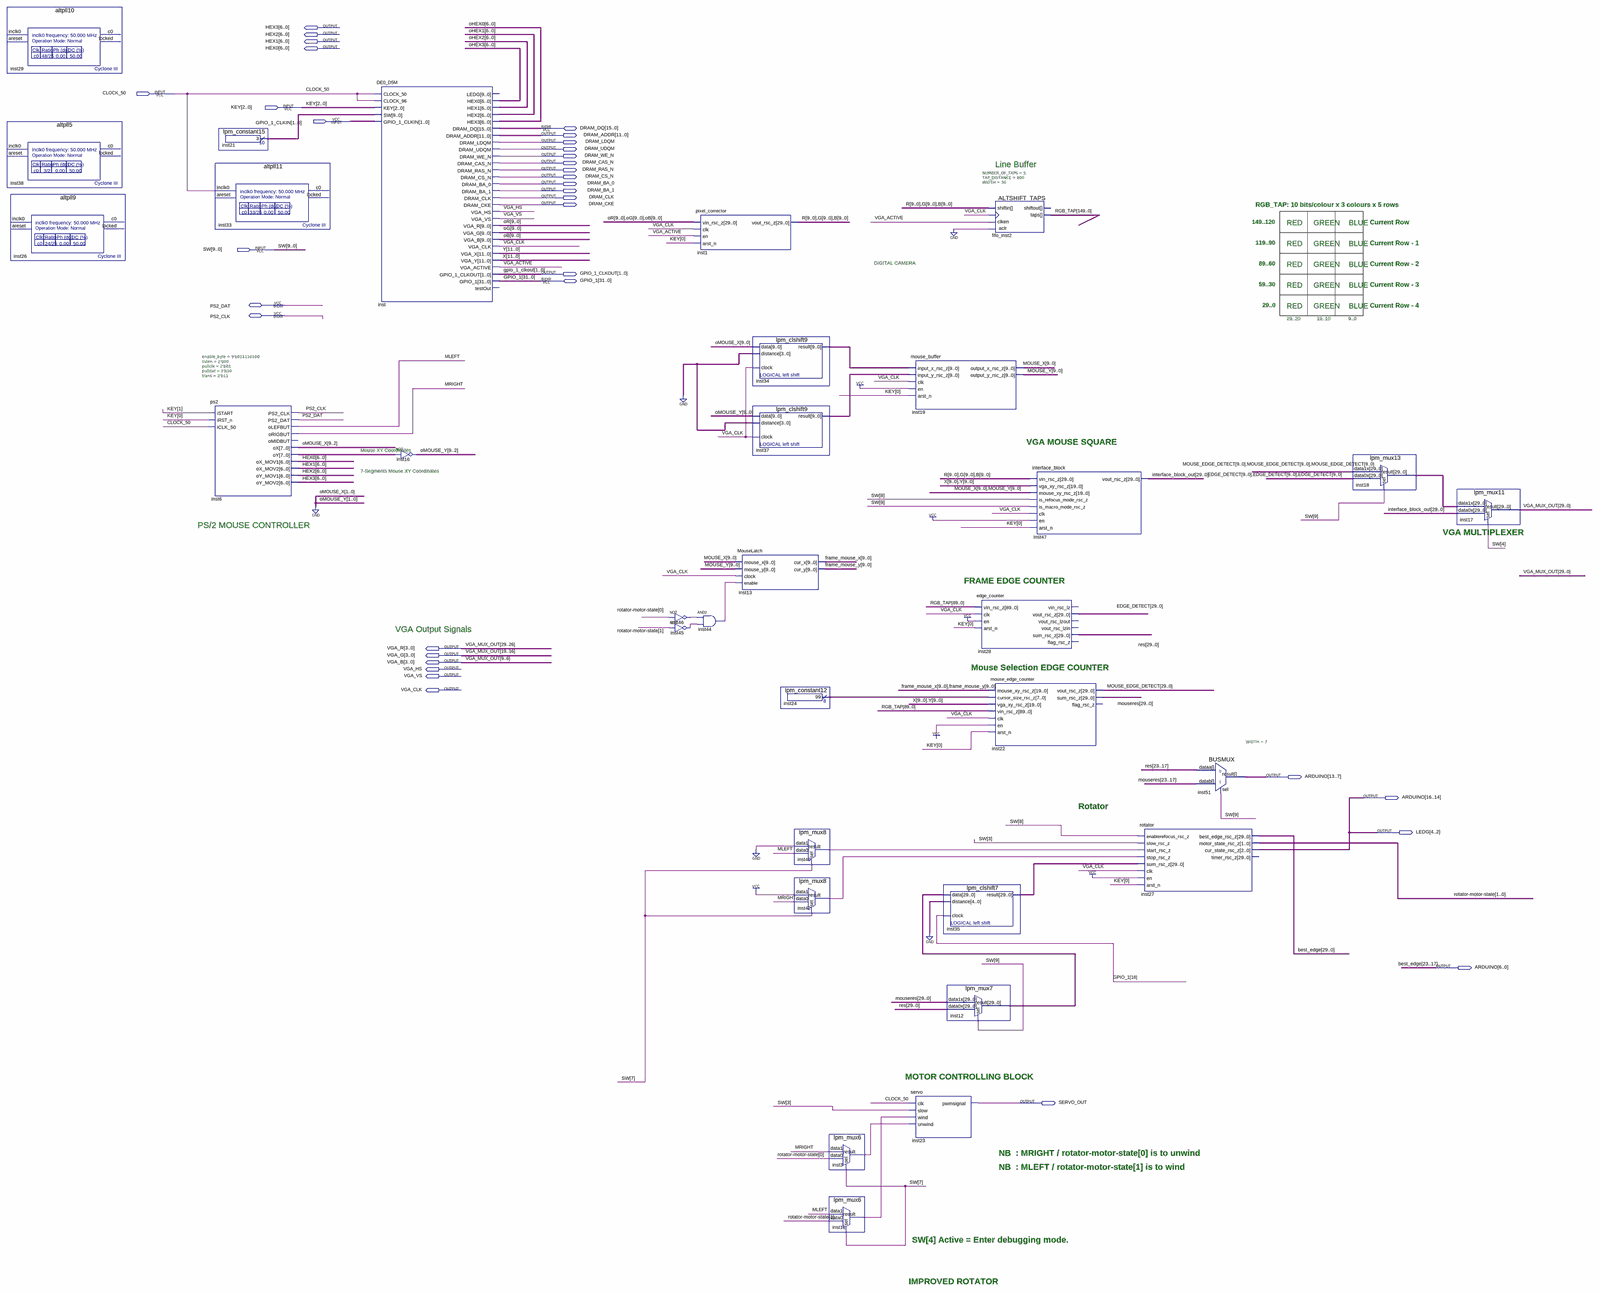
[diagram p0: schematic sheet, whole]
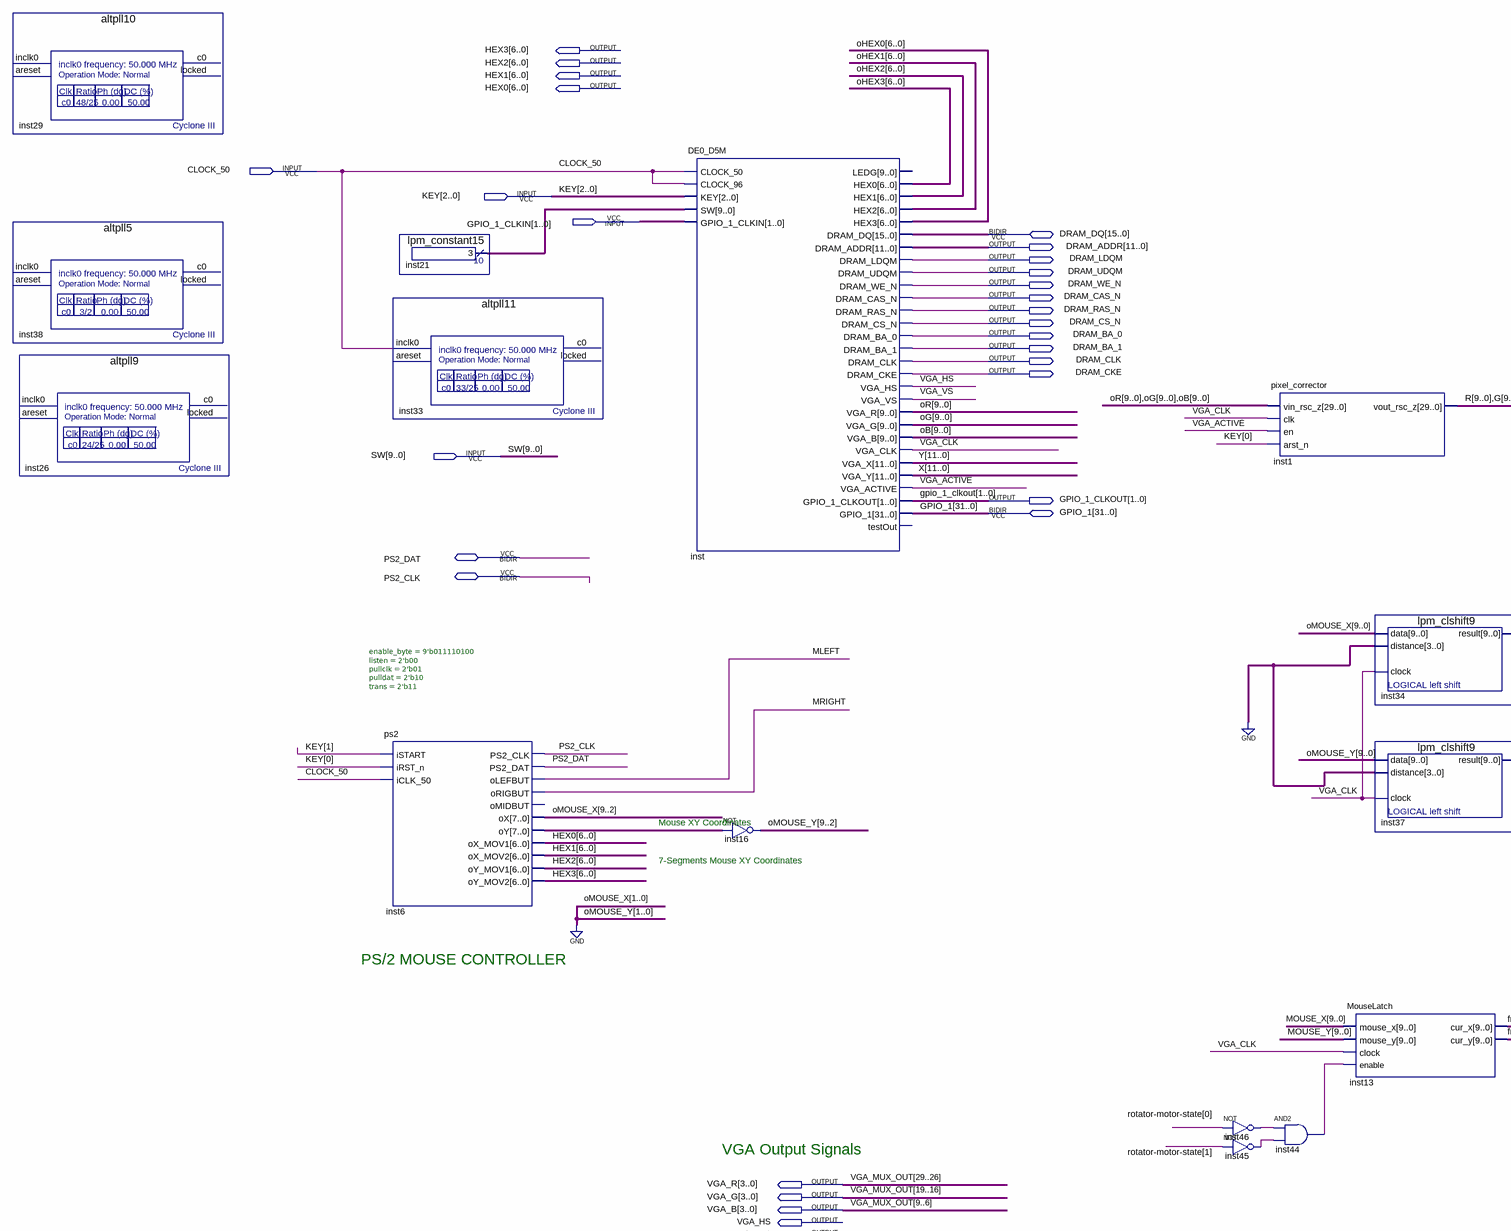
[diagram p1: schematic sheet, upper left part]
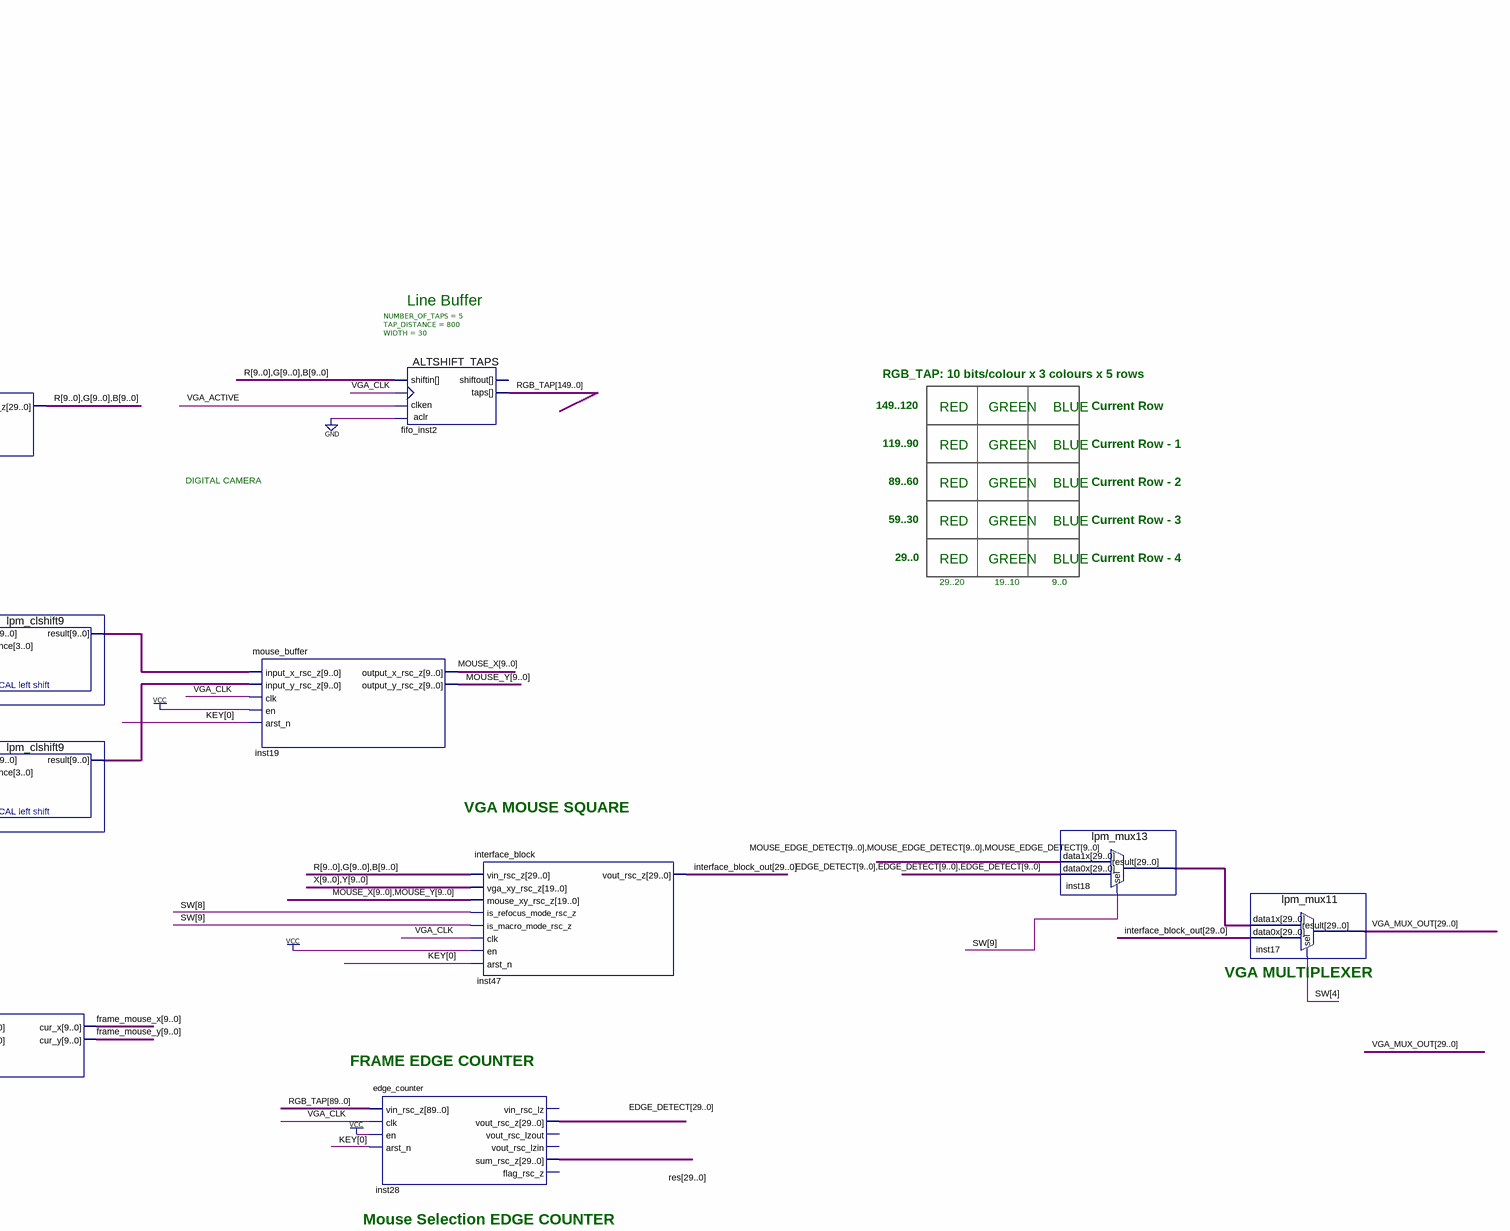
[diagram p2: schematic sheet, upper right part]
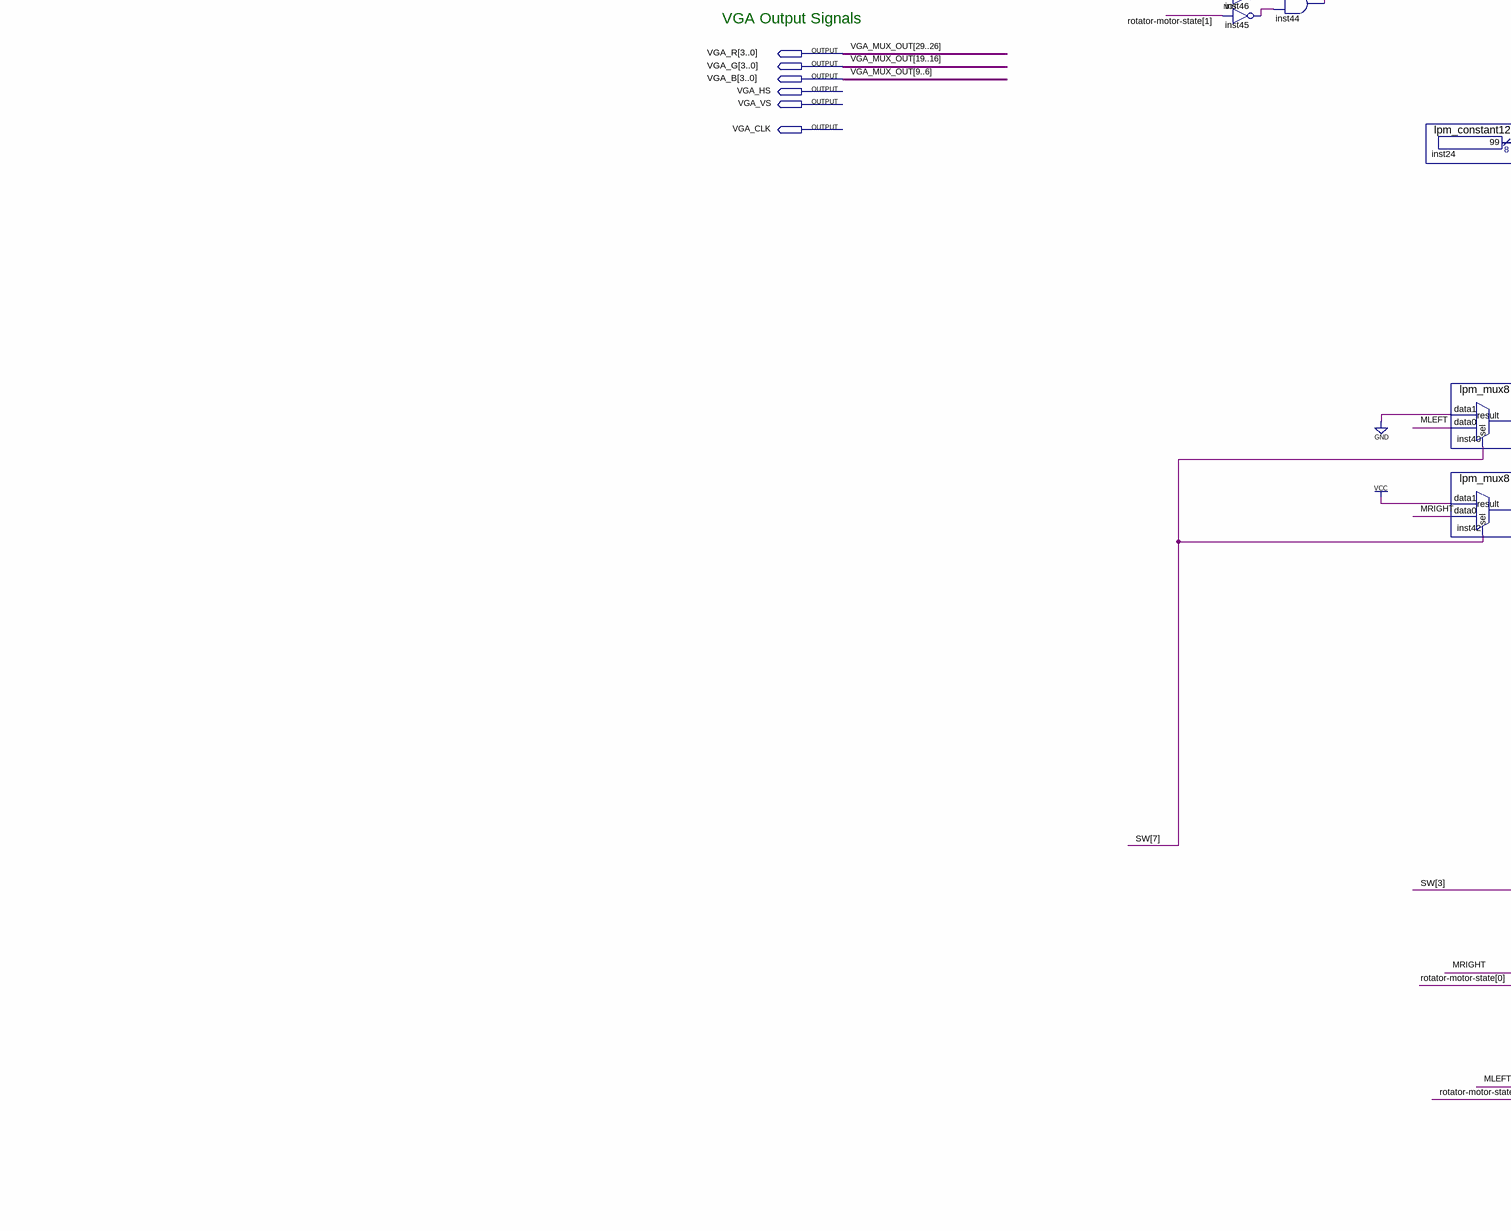
[diagram p3: schematic sheet, lower left part]
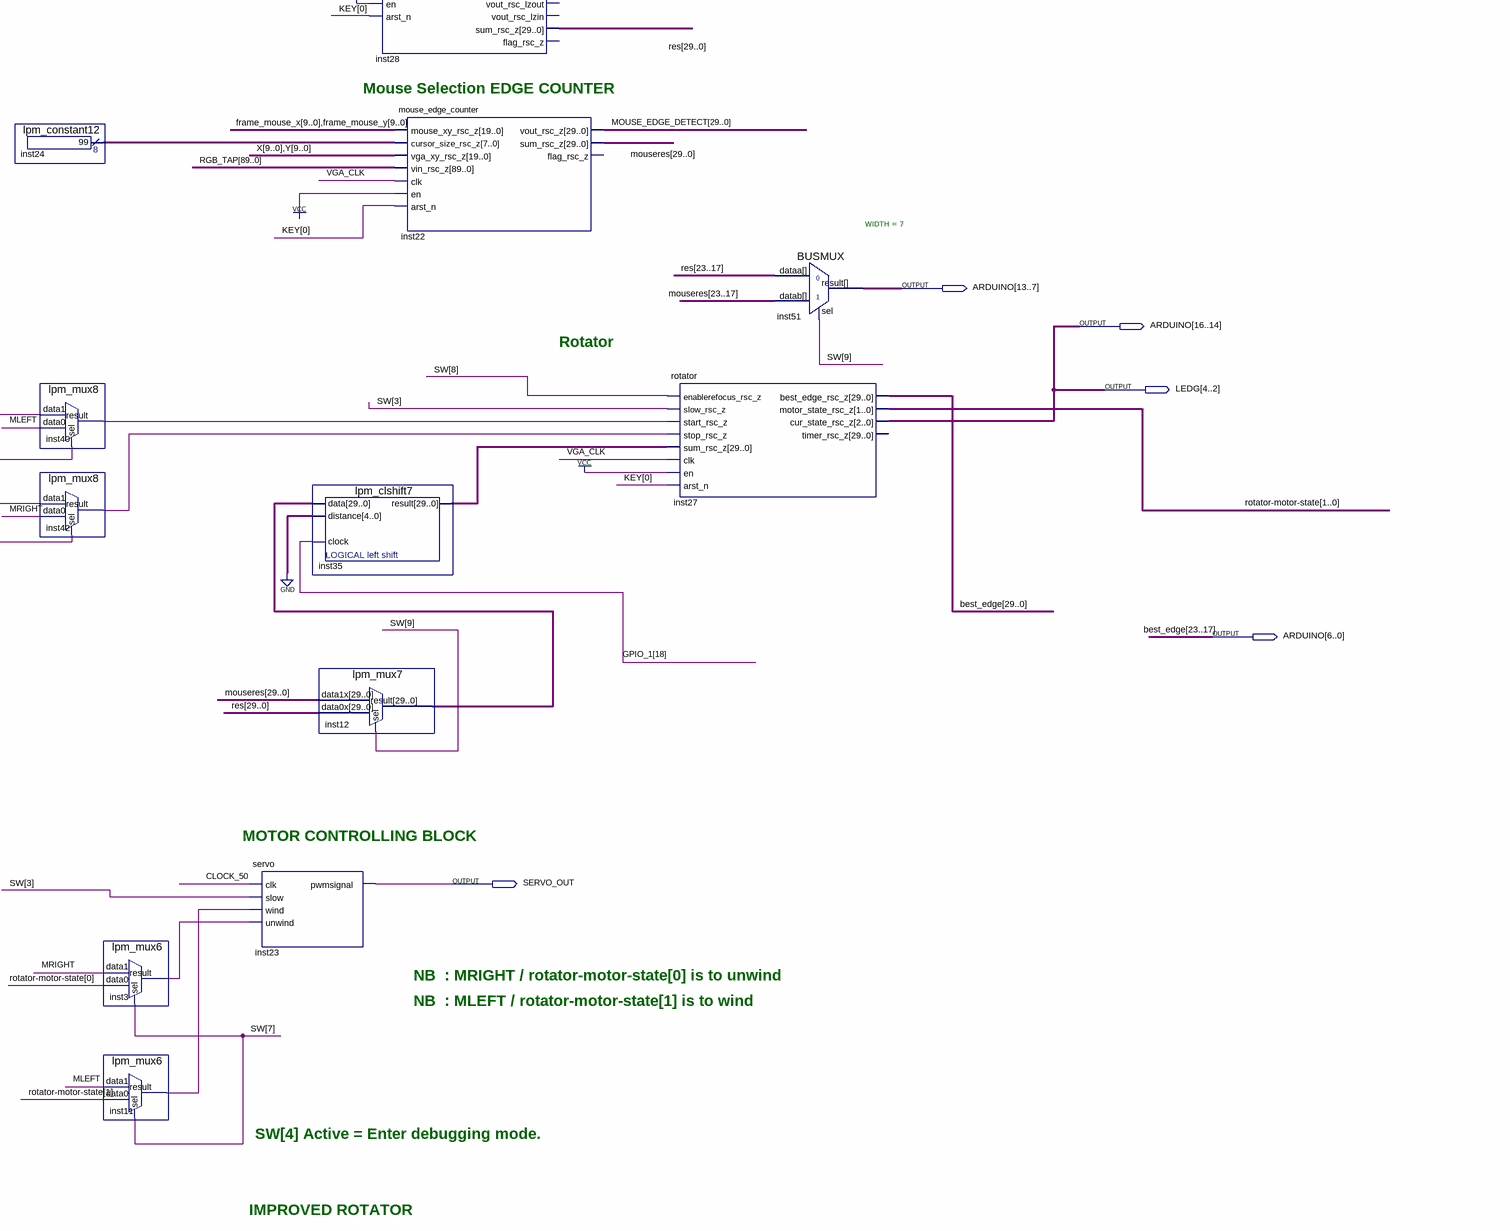
[diagram p4: schematic sheet, lower right part]
// Quartus schematic TOP_DE0_CAMERA_MOUSE.bdf as structural Verilog: 32 symbols, 35 pins
module TOP_DE0_CAMERA_MOUSE (
  input  CLOCK_50,
  input  [2:0] KEY,
  input  [1:0] GPIO_1_CLKIN,
  input  [9:0] SW,
  inout  [15:0] DRAM_DQ,
  inout  [31:0] GPIO_1,
  inout  PS2_DAT,
  inout  PS2_CLK,
  output [6:0] HEX3,
  output [6:0] HEX2,
  output [6:0] HEX1,
  output [6:0] HEX0,
  output [11:0] DRAM_ADDR,
  output DRAM_LDQM,
  output DRAM_UDQM,
  output DRAM_WE_N,
  output DRAM_CAS_N,
  output DRAM_RAS_N,
  output DRAM_CS_N,
  output DRAM_BA_0,
  output DRAM_BA_1,
  output DRAM_CLK,
  output DRAM_CKE,
  output [1:0] GPIO_1_CLKOUT,
  output [3:0] VGA_R,
  output [3:0] VGA_G,
  output [3:0] VGA_B,
  output VGA_HS,
  output VGA_VS,
  output VGA_CLK,
  output [16:0] ARDUINO,
  output [4:2] LEDG,
  output SERVO_OUT
);

  wire inst3_result, inst11_result, inst40_result, inst42_result, inst44_out, inst45_out, inst46_out, MLEFT,
       MRIGHT, VGA_ACTIVE;
  wire [1:0] \rotator-motor-state ;
  wire [6:0] oHEX0, oHEX1, oHEX2, oHEX3;
  wire [7:0] inst6_oy, inst24_result;
  wire [9:0] B, frame_mouse_x, frame_mouse_y, G, inst21_result, inst34_result, inst37_result, MOUSE_X,
       MOUSE_Y, oB, oG, oMOUSE_X, oR, R;
  wire [9:2] oMOUSE_Y;
  wire [11:0] X, Y;
  wire [25:0] VGA_MUX_OUT;
  wire [29:0] best_edge, EDGE_DETECT, inst12_result, inst18_result, inst35_result, interface_block_out,
       MOUSE_EDGE_DETECT, mouseres, res;
  wire [149:0] RGB_TAP;

  altpll10 inst29 ();  // open: inclk0, areset, c0, locked
  altpll5 inst38 ();  // open: inclk0, areset, c0, locked
  altpll9 inst26 ();  // open: inclk0, areset, c0, locked
  lpm_constant15 inst21 (.result(inst21_result));
  altpll11 inst33 (.inclk0(CLOCK_50));  // open: areset, c0, locked
  ps2 #(.enable_byte(9'b011110100), .listen(2'b00), .pullclk(2'b01), .pulldat(2'b10), .trans(2'b11)) inst6 (
    .iSTART(KEY[1]), .iRST_n(KEY[0]), .iCLK_50(CLOCK_50), .oLEFBUT(MLEFT), .oRIGBUT(MRIGHT),
    .oX(oMOUSE_X[9:2]), .oY(inst6_oy), .oX_MOV1(HEX0), .oX_MOV2(HEX1), .oY_MOV1(HEX2), .oY_MOV2(HEX3),
    .PS2_CLK(PS2_CLK), .PS2_DAT(PS2_DAT));  // open: oMIDBUT
  DE0_D5M inst (
    .CLOCK_50(CLOCK_50), .CLOCK_96(CLOCK_50), .KEY(KEY), .SW(inst21_result), .GPIO_1_CLKIN(GPIO_1_CLKIN),
    .HEX0(oHEX3), .HEX1(oHEX2), .HEX2(oHEX1), .HEX3(oHEX0), .DRAM_ADDR(DRAM_ADDR), .DRAM_LDQM(DRAM_LDQM),
    .DRAM_UDQM(DRAM_UDQM), .DRAM_WE_N(DRAM_WE_N), .DRAM_CAS_N(DRAM_CAS_N), .DRAM_RAS_N(DRAM_RAS_N),
    .DRAM_CS_N(DRAM_CS_N), .DRAM_BA_0(DRAM_BA_0), .DRAM_BA_1(DRAM_BA_1), .DRAM_CLK(DRAM_CLK),
    .DRAM_CKE(DRAM_CKE), .VGA_HS(VGA_HS), .VGA_VS(VGA_VS), .VGA_R(oR), .VGA_G(oG), .VGA_B(oB),
    .VGA_CLK(VGA_CLK), .VGA_X(Y), .VGA_Y(X), .VGA_ACTIVE(VGA_ACTIVE), .GPIO_1_CLKOUT(GPIO_1_CLKOUT),
    .DRAM_DQ(DRAM_DQ), .GPIO_1(GPIO_1));  // open: LEDG, testOut
  assign oMOUSE_Y = ~inst6_oy;  // NOT inst16, 8 bits wide
  not inst46 (inst46_out, \rotator-motor-state [0]);
  not inst45 (inst45_out, \rotator-motor-state [1]);
  pixel_corrector inst1 (
    .vin_rsc_z({oR, oG, oB}), .clk(VGA_CLK), .en(VGA_ACTIVE), .arst_n(KEY[0]), .vout_rsc_z({R, G, B}));
  and inst44 (inst44_out, inst46_out, inst45_out);
  lpm_clshift9 inst34 (.data(oMOUSE_X), .distance(4'b0000), .clock(VGA_CLK), .result(inst34_result));
  lpm_clshift9 inst37 (.data({oMOUSE_Y, 2'b00}), .distance(4'b0000), .clock(VGA_CLK), .result(inst37_result));
  MouseLatch inst13 (
    .mouse_x(MOUSE_X), .mouse_y(MOUSE_Y), .clock(VGA_CLK), .enable(inst44_out), .cur_x(frame_mouse_x),
    .cur_y(frame_mouse_y));
  lpm_constant12 inst24 (.result(inst24_result));
  lpm_mux8 inst40 (.data1(1'b0), .data0(MLEFT), .sel(SW[7]), .result(inst40_result));
  lpm_mux8 inst42 (.data1(1'b1), .data0(MRIGHT), .sel(SW[7]), .result(inst42_result));
  lpm_mux6 inst3 (.data1(MRIGHT), .data0(\rotator-motor-state [0]), .sel(SW[7]), .result(inst3_result));
  lpm_mux6 inst11 (.data1(MLEFT), .data0(\rotator-motor-state [1]), .sel(SW[7]), .result(inst11_result));
  mouse_buffer inst19 (
    .input_x_rsc_z(inst34_result), .input_y_rsc_z(inst37_result), .clk(VGA_CLK), .en(1'b1), .arst_n(KEY[0]),
    .output_x_rsc_z(MOUSE_X), .output_y_rsc_z(MOUSE_Y));
  servo inst23 (.clk(CLOCK_50), .slow(SW[3]), .wind(inst11_result), .unwind(inst3_result), .pwmsignal(SERVO_OUT));
  lpm_clshift7 inst35 (.data(inst12_result), .distance({5{1'b0}}), .clock(GPIO_1[18]), .result(inst35_result));
  lpm_mux7 inst12 (.data1x(mouseres), .data0x(res), .sel(SW[9]), .result(inst12_result));
  edge_counter inst28 (
    .vin_rsc_z(RGB_TAP[89:0]), .clk(VGA_CLK), .en(1'b1), .arst_n(KEY[0]), .sum_rsc_z(res),
    .vout_rsc_z(EDGE_DETECT));  // open: vin_rsc_lz, vout_rsc_lzout, vout_rsc_lzin, flag_rsc_z
  ALTSHIFT_TAPS #(.NUMBER_OF_TAPS(5), .TAP_DISTANCE(800), .WIDTH(30)) fifo_inst2 (
    .shiftin({R, G, B}), .clken(VGA_ACTIVE), .clock(VGA_CLK), .aclr(1'b0), .taps(RGB_TAP));  // open: shiftout
  mouse_edge_counter inst22 (
    .mouse_xy_rsc_z({frame_mouse_x, frame_mouse_y}), .cursor_size_rsc_z(inst24_result),
    .vga_xy_rsc_z({X[9:0], Y[9:0]}), .vin_rsc_z(RGB_TAP[89:0]), .clk(VGA_CLK), .en(1'b1), .arst_n(KEY[0]),
    .vout_rsc_z(MOUSE_EDGE_DETECT), .sum_rsc_z(mouseres));  // open: flag_rsc_z
  interface_block inst47 (
    .vin_rsc_z({R, G, B}), .vga_xy_rsc_z({X[9:0], Y[9:0]}), .mouse_xy_rsc_z({MOUSE_X, MOUSE_Y}),
    .is_refocus_mode_rsc_z(SW[8]), .is_macro_mode_rsc_z(SW[9]), .clk(VGA_CLK), .en(1'b1), .arst_n(KEY[0]),
    .vout_rsc_z(interface_block_out));
  rotator inst27 (
    .enablerefocus_rsc_z(SW[8]), .slow_rsc_z(SW[3]), .start_rsc_z(inst40_result), .stop_rsc_z(inst42_result),
    .sum_rsc_z(inst35_result), .clk(VGA_CLK), .en(1'b1), .arst_n(KEY[0]),
    .best_edge_rsc_z({best_edge[29:24], ARDUINO[6:0], best_edge[16:0]}),
    .motor_state_rsc_z(\rotator-motor-state ), .cur_state_rsc_z(ARDUINO[16:14]));  // open: timer_rsc_z
  BUSMUX #(.WIDTH(7)) inst51 (.datab(mouseres[23:17]), .sel(SW[9]), .dataa(res[23:17]), .result(ARDUINO[13:7]));
  lpm_mux13 inst18 (
    .data1x({MOUSE_EDGE_DETECT[9:0], MOUSE_EDGE_DETECT[9:0], MOUSE_EDGE_DETECT[9:0]}),
    .data0x({EDGE_DETECT[9:0], EDGE_DETECT[9:0], EDGE_DETECT[9:0]}), .sel(SW[9]), .result(inst18_result));
  lpm_mux11 inst17 (
    .data1x(inst18_result), .data0x(interface_block_out), .sel(SW[4]),
    .result({VGA_R, VGA_MUX_OUT[25:20], VGA_G, VGA_MUX_OUT[15:10], VGA_B, VGA_MUX_OUT[5:0]}));

  assign LEDG = ARDUINO[16:14];

  // Other names for the same wires on the sheet: best_edge[23:17] = ARDUINO[6:0];
  //   VGA_MUX_OUT (some bits) = {VGA_R, VGA_G, VGA_B}

  // Notes on the sheet:
  //   Line Buffer
  //   RGB_TAP: 10 bits/colour x 3 colours x 5 rows
  //   149..120
  //   RED     GREEN    BLUE
  //   Current Row
  //   119..90
  //   RED     GREEN    BLUE
  //   Current Row - 1
  //   DIGITAL CAMERA
  //   89..60
  //   RED     GREEN    BLUE
  //   Current Row - 2
  //   59..30
  //   RED     GREEN    BLUE
  //   Current Row - 3
  //   29..0
  //   RED     GREEN    BLUE
  //   Current Row - 4
  //   29..20            19..10             9..0
  //   VGA MOUSE SQUARE
  //   Mouse XY Coordinates
  //   7-Segments Mouse XY Coordinates
  //   PS/2 MOUSE CONTROLLER
  //   VGA MULTIPLEXER
  //   FRAME EDGE COUNTER
  //   VGA Output Signals
  //   Mouse Selection EDGE COUNTER
  //   Rotator
  //   MOTOR CONTROLLING BLOCK
  //   NB  : MRIGHT / rotator-motor-state[0] is to unwind
  //   NB  : MLEFT / rotator-motor-state[1] is to wind
  //   SW[4] Active = Enter debugging mode.
  //   IMPROVED ROTATOR
endmodule
